# Altium schematic sheet Motor2.SchDoc
size A; SheetNumber: 2; SheetTotal: 4
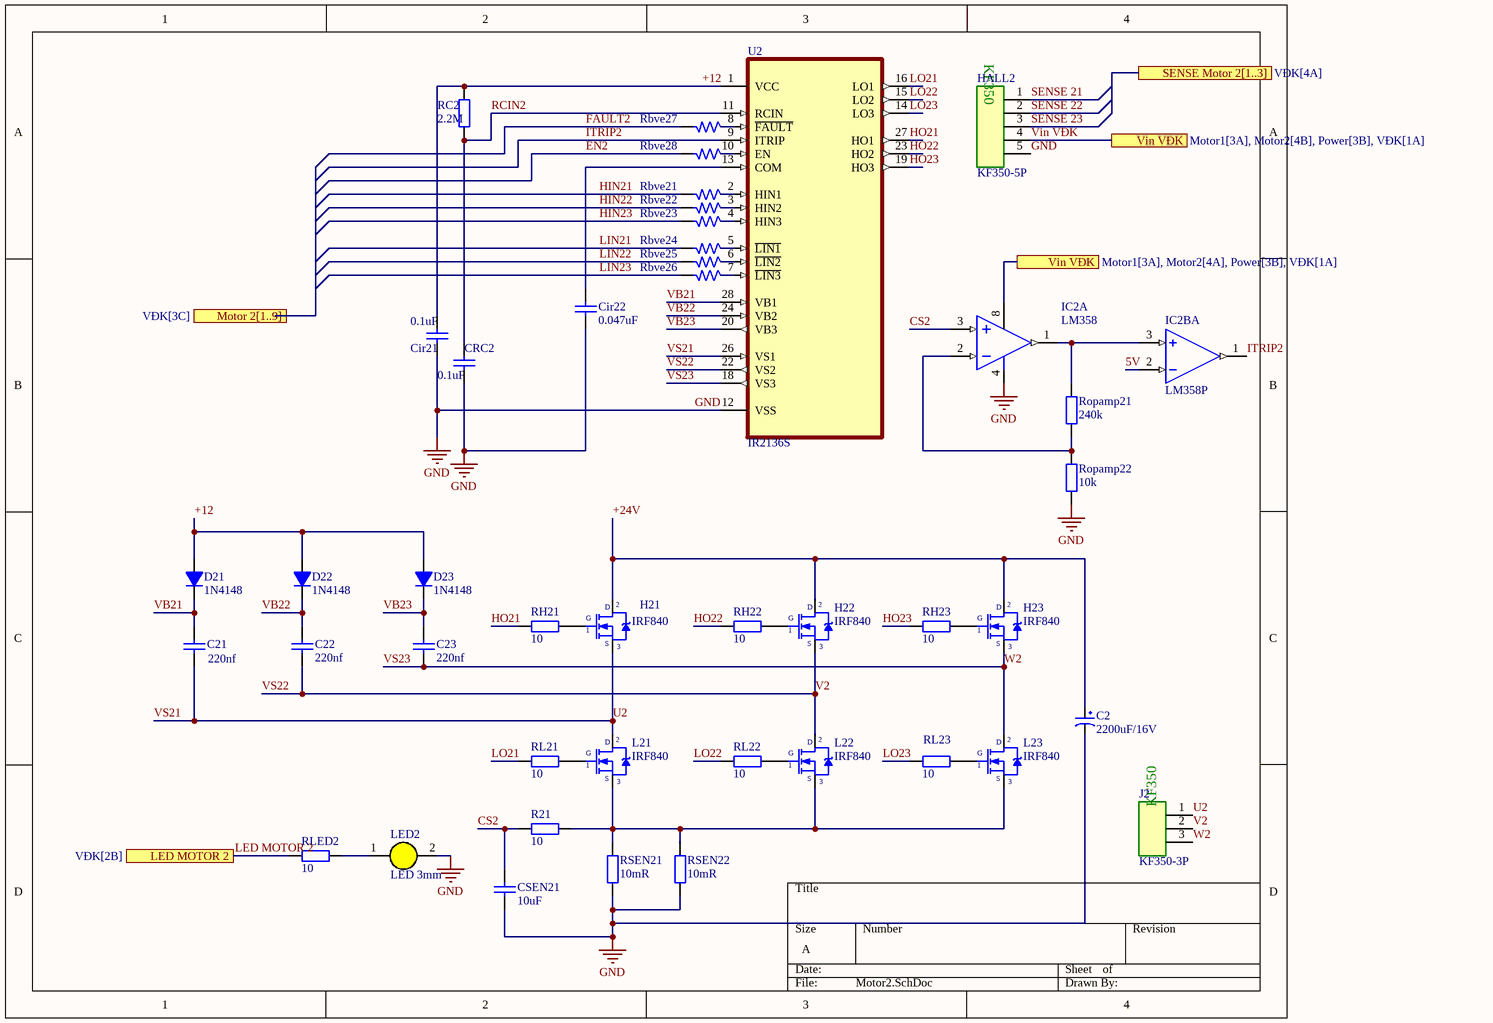
[diagram p0: Motor2.SchDoc]

## Parts
C2  2200uF/16V  [CP2/4]
C21  value 220nf  [Tu-pico]  (hidden comment: Capacitor Ceramic)
C22  value 220nf  [Tu-pico]  (hidden comment: Capacitor Ceramic)
C23  value 220nf  [Tu-pico]  (hidden comment: Capacitor Ceramic)
Cir21  value 0.1uF  [Tu-pico]  (hidden comment: Capacitor Ceramic)
Cir22  value 0.047uF  [Tu-pico]  (hidden comment: Capacitor Ceramic)
CRC2  value 0.1uF  [Tu-pico]  (hidden comment: Capacitor Ceramic)
CSEN21  value 10uF  [Tu-pico]  (hidden comment: Capacitor Ceramic)
D21  1N4148  [D0.5A]
D22  1N4148  [D0.5A]
D23  1N4148  [D0.5A]
H21  IRF840  [QTO-220]
H22  IRF840  [QTO-220]
H23  IRF840  [QTO-220]
HALL2  KF350-5P  [KF350-5P]
IC2  LM358  [DIP8/W0.3]  (part A of 2)
IC2B  LM358P  [DIP794W45P254L959H508Q8]  (part A of 3)
J2  KF350-3P  [KF350-3P]
L21  IRF840  [QTO-220]
L22  IRF840  [QTO-220]
L23  IRF840  [QTO-220]
LED2  LED 3mm  [LED-3MM-YELLOW]
R21  10  [R1/4W]
Rbve21  1m  [SM-1206]  (value not drawn)
Rbve22  1m  [SM-1206]  (value not drawn)
Rbve23  1m  [SM-1206]  (value not drawn)
Rbve24  1m  [SM-1206]  (value not drawn)
Rbve25  1m  [SM-1206]  (value not drawn)
Rbve26  1m  [SM-1206]  (value not drawn)
Rbve27  1m  [SM-1206]  (value not drawn)
Rbve28  1m  [SM-1206]  (value not drawn)
RC2  2.2M  [R1/4W]
RH21  10  [R1/4W]
RH22  10  [R1/4W]
RH23  10  [R1/4W]
RL21  10  [R1/4W]
RL22  10  [R1/4W]
RL23  10  [R1/4W]
RLED2  10  [R1/4W]
Ropamp21  240k  [R1/4W]
Ropamp22  10k  [R1/4W]
RSEN21  10mR  [Shunt 10mR 1.2x10x7MM]
RSEN22  10mR  [Shunt 10mR 1.2x10x7MM]
U2  IR2136S  [SOIC127PX1032X265-28N]

## Ports
LED MOTOR 2 (see VĐK[2B]), Motor 2[1..9] (see VĐK[3C]), SENSE Motor 2[1..3] (see VĐK[4A]), Vin VĐK (see Motor1[3A], Motor2[4A], Power[3B], VĐK[1A]), Vin VĐK (see Motor1[3A], Motor2[4B], Power[3B], VĐK[1A])

## Nets
GND: C2.2 Cir21.2 Cir22.2 CRC2.2 CSEN21.2 HALL2.5 IC2.4(-V) LED2.2(K) Ropamp22.2 RSEN21.1 RSEN22.1 U2.12(VSS)
5V: IC2B.2(-IN1)
+12: Cir21.1 D21.1(A) D22.1(A) D23.1(A) RC2.2 U2.1(VCC)
+24V: C2.1 H21.2(D) H22.2(D) H23.2(D)
CS2: CSEN21.1 IC2.3(IN+) R21.2
EN2: Rbve28.2
FAULT2: Rbve27.2
HIN21: Rbve21.2
HIN22: Rbve22.2
HIN23: Rbve23.2
HO21: RH21.1 U2.27(HO1)
HO22: RH22.1 U2.23(HO2)
HO23: RH23.1 U2.19(HO3)
ITRIP2: IC2B.1(OUT1) U2.9(ITRIP)
LED MOTOR 2: RLED2.2 ; port LED MOTOR 2
LIN21: Rbve24.2
LIN22: Rbve25.2
LIN23: Rbve26.2
LO21: RL21.1 U2.16(LO1)
LO22: RL22.1 U2.15(LO2)
LO23: RL23.2 U2.14(LO3)
RCIN2: CRC2.1 RC2.1 U2.11(RCIN)
SENSE 21: HALL2.1
SENSE 22: HALL2.2
SENSE 23: HALL2.3
U2: C21.2 H21.3(S) J2.1 L21.2(D) U2.26(VS1)  [also labelled VS21]
V2: C22.2 H22.3(S) J2.2 L22.2(D) U2.22(VS2)  [also labelled VS22]
VB21: C21.1 D21.2(K) U2.28(VB1)
VB22: C22.1 D22.2(K) U2.24(VB2)
VB23: C23.1 D23.2(K) U2.20(VB3)
Vin VĐK: HALL2.4 IC2.8(+V) ; port Vin VĐK
VS23: C23.2 H23.3(S) J2.3 L23.2(D) U2.18(VS3)  [also labelled W2]
NetCir22_1: Cir22.1 U2.13(COM)
NetH21_1: H21.1(G) RH21.2
NetH22_1: H22.1(G) RH22.2
NetH23_1: H23.1(G) RH23.2
NetIC2_1: IC2.1(OUT) IC2B.3(+IN1) Ropamp21.1
NetIC2_2: IC2.2(IN-) Ropamp21.2 Ropamp22.1
NetL21_1: L21.1(G) RL21.2
NetL21_3: L21.3(S) L22.3(S) L23.3(S) R21.1 RSEN21.2 RSEN22.2
NetL22_1: L22.1(G) RL22.2
NetL23_1: L23.1(G) RL23.1
NetLED2_1: LED2.1(A) RLED2.1
NetRbve21_1: Rbve21.1 U2.2(HIN1)
NetRbve22_1: Rbve22.1 U2.3(HIN2)
NetRbve23_1: Rbve23.1 U2.4(HIN3)
NetRbve24_1: Rbve24.1 U2.5(~{LIN1})
NetRbve25_1: Rbve25.1 U2.6(~{LIN2})
NetRbve26_1: Rbve26.1 U2.7(~{LIN3})
NetRbve27_1: Rbve27.1 U2.8(~{FAULT})
NetRbve28_1: Rbve28.1 U2.10(EN)

## Notes on the sheet
- (in symbol KF350-3P) KF350
- (in symbol KF350-5P) KF350

## Library data of the parts
C2 = CP5: Cap 2200uF/16V - 1000uF/50V; Description 5: 47uF/200V - 22uF/350V - 400V - 10uF/450V; Description 1: 4700uF-6800uF/6,3V - 3300uF-4700uF/10V; Description 2: 2200uF-3300uF/16V - 470uF => 2200uF/25V; Description 3: 1000uF/35V-50V_470uF/63V_220uF>330uF/100V; Description 4: 47uF => 100uF/160V - 33uF-47uF/250V; Value: 2200uF/16V
C21-C23 Cir21 Cir22 CRC2 CSEN21 = CapCeramic: Capacitor; Published: 8-Jun-2000; LatestRevisionDate: 17-Jul-2002; LatestRevisionNote: Re-released for DXP Platform.; PackageReference: RAD-0.3; Publisher: Altium Limited
D21-D23 = D0.5A: Value: 1N4148
H21-H23 L21-L23 = IRF840: MOSFET N - CHANNEL 500V - 0.75 - 8A - TO-220; Value: IRF840
IC2 = LM358: Low-Power Dual Operational Amplifier; Value: LM358
IC2B = LM358P: Dual, 30-V, 700-kHz operational amplifier; MF: Texas Instruments; SnapEDA_Link: https://www.snapeda.com/parts/LM358P/Texas+Instruments/view-part/?ref=snap; Package: PDIP-8 Texas; Value: *; MP: LM358P; Check_prices: https://www.snapeda.com/parts/LM358P/Texas+Instruments/view-part/?ref=eda
LED2 = LED 3mm Vang: Cắm; Don_Vi: Con; Ma_Hang: MH003893; Ten_Linh_Kien: Led 3MM Phủ Vàng (10c); Ghi_Chu: *; Kieu_Chan: *; Chung_Loai: Cắm
R21 RC2 RH21-RH23 RL21-RL23 RLED2 Ropamp21 Ropamp22 = R1/4W: Resistor 1/4W; Value: R1/4W - 1K
Rbve21-Rbve28 = R: Resistor 1/4W; Value: R1/4W - 1K
RSEN21 RSEN22 = Shunt 10mR 1.2x10x7MM
U2 = IR2136S: IC Ä‘iá»u khiá»ƒn ná»­a cáº§u cá»•ng Ä‘áº£o ngÆ°á»£c 28-SOIC; MF: Infineon; Package: SOIC-28 Infineon; Availability: Unavailable; MP: IR2136S; Value: *; SnapEDA_Link: https://www.snapeda.com/parts/IR2136S/Infineon%20Technologies/view-part/652863/?ref=snap; Price: None